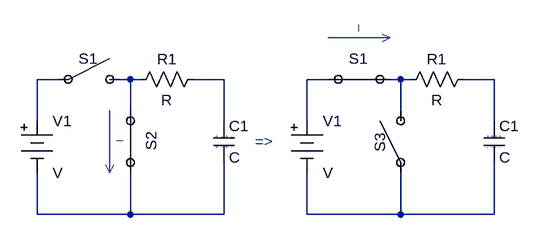
[diagram p0: schematic Charging Cap.asc]
Charging Cap.asc, the LTspice schematic file:
Version 4
SHEET 1 880 680
WIRE 112 96 80 96
WIRE 224 96 208 96
WIRE 240 96 224 96
WIRE 368 96 320 96
WIRE 528 96 496 96
WIRE 640 96 624 96
WIRE 656 96 640 96
WIRE 784 96 736 96
WIRE 224 144 224 96
WIRE 640 144 640 96
WIRE 80 160 80 96
WIRE 368 160 368 96
WIRE 496 160 496 96
WIRE 784 160 784 96
WIRE 80 304 80 240
WIRE 224 304 224 240
WIRE 224 304 80 304
WIRE 368 304 368 224
WIRE 368 304 224 304
WIRE 496 304 496 240
WIRE 640 304 640 240
WIRE 640 304 496 304
WIRE 784 304 784 224
WIRE 784 304 640 304
SYMBOL Misc\\battery 80 144 R0
SYMATTR InstName V1
SYMBOL res 336 80 R90
WINDOW 0 0 56 VBottom 2
WINDOW 3 32 56 VTop 2
SYMATTR InstName R1
SYMBOL cap 352 160 R0
SYMATTR InstName C1
SYMBOL Misc\\battery 496 144 R0
SYMATTR InstName V1
SYMBOL res 752 80 R90
WINDOW 0 0 56 VBottom 2
WINDOW 3 32 56 VTop 2
SYMATTR InstName R1
SYMBOL cap 768 160 R0
SYMATTR InstName C1
SYMBOL SPST 160 80 R0
WINDOW 0 -16 -16 Left 2
SYMATTR InstName S1
SYMBOL SPST\ -\ Closed 240 192 R90
WINDOW 0 -16 -16 Left 2
SYMATTR InstName S2
SYMBOL SPST\ -\ Closed 576 80 R0
WINDOW 0 -16 -16 Left 2
SYMATTR InstName S1
SYMBOL SPST 624 192 R270
WINDOW 0 -16 -16 Left 2
SYMATTR InstName S3
TEXT 368 184 Center 0 ;+ - + -
TEXT 368 200 Center 0 ;+ - + -
TEXT 784 184 Center 0 ;++++
TEXT 784 200 Center 0 ;- - - -
TEXT 576 16 Center 1 ;I
TEXT 416 192 Left 2 ;=>
TEXT 208 192 VCenter 1 ;I
LINE Normal 624 32 528 32
LINE Normal 612 26 624 32
LINE Normal 624 32 612 26
LINE Normal 612 38 624 32
LINE Normal 192 240 192 144
LINE Normal 198 228 192 240
LINE Normal 192 240 198 228
LINE Normal 186 228 192 240

The netlist it stands for:
* Charging Cap.asc
V1 N001 N007 V
R1 N003 N002 R
C1 N003 N007 C
V1 N004 N008 V
R1 N006 N005 R
C1 N006 N008 C
XS1 N001 N002 SPST
XS2 N002 N007 SPST - Closed
XS1 N004 N005 SPST - Closed
XS3 N008 N005 SPST
* + - + -
* + - + -
* ++++
* - - - -
* I
* =>
* I
.backanno
.end